# Altium schematic sheet SOM Analog USB.SchDoc: SOM/Analog/USB
size Tabloid; ApprovedBy: NA; CompanyName: Cospan Design LLC; DrawnBy: David McCoy; Engineer: David McCoy; DocumentNumber: 4; Revision: A; SheetNumber: 4; SheetTotal: 18; Client: OSH; Project: Guppy Buddy; ProjectPrettyName: Guppy Buddy
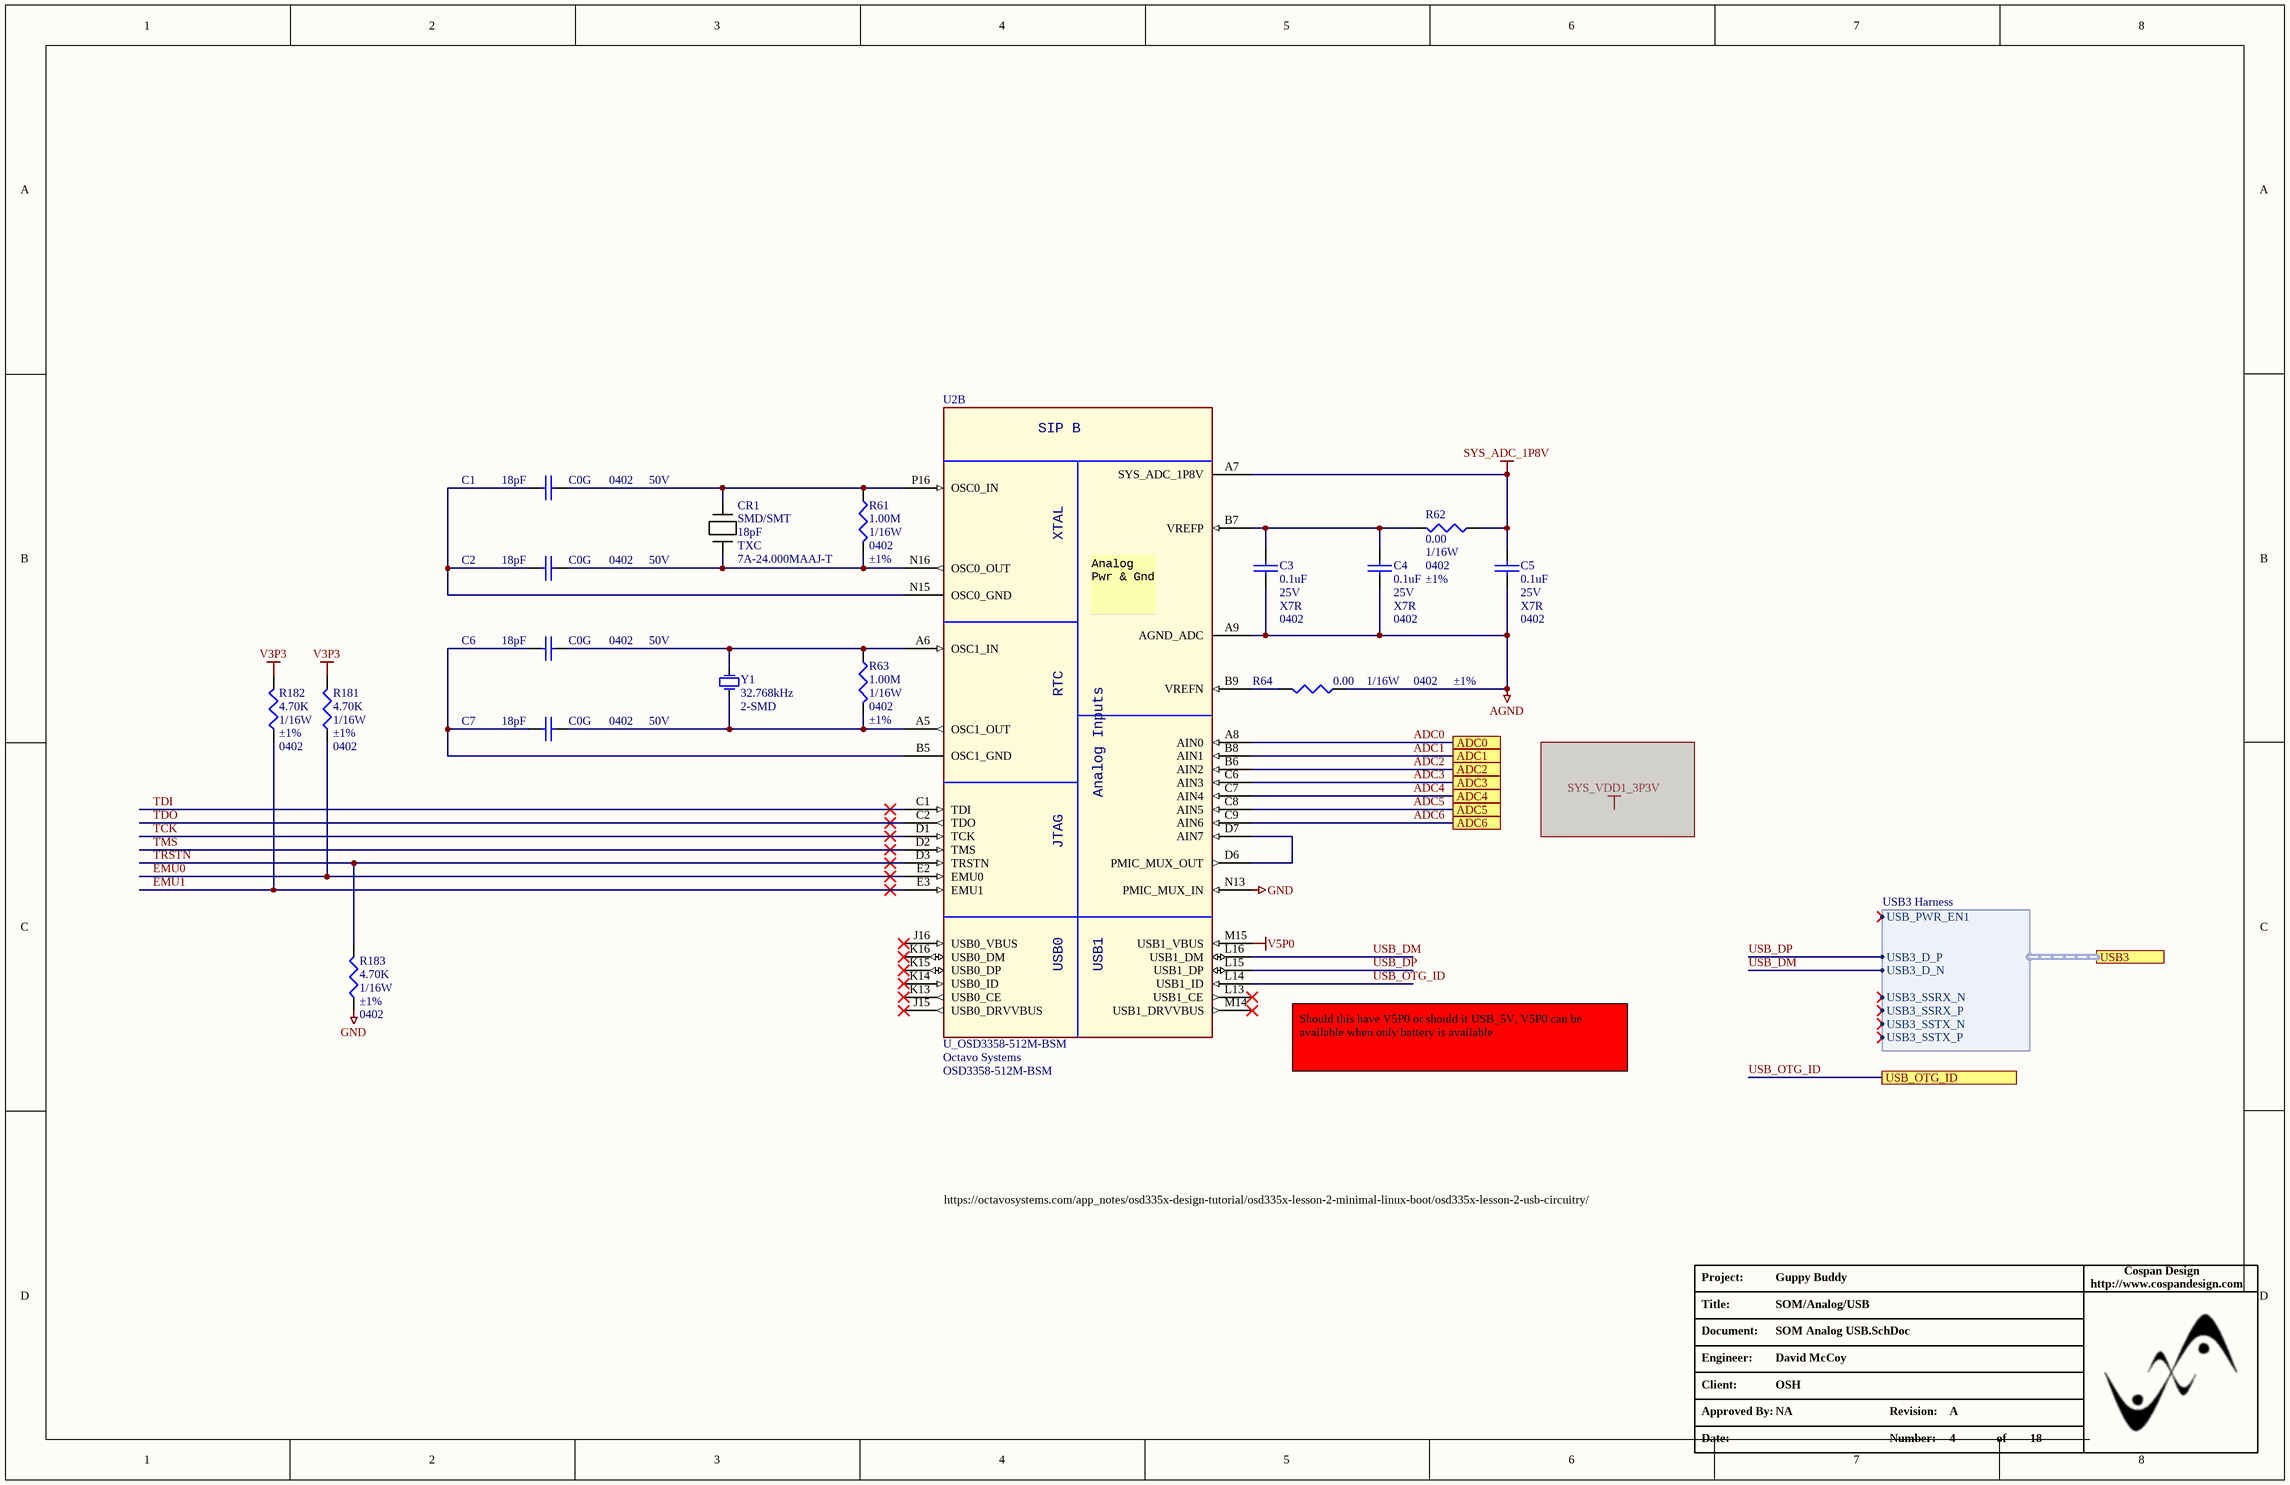
[diagram p0: SOM Analog USB.SchDoc]

## Parts
C1  Capacitance: 18pF  Dielectric: C0G  Case Code (Imperial): 0402  Voltage Rating: 50V  [C_0402]  (hidden comment: C_0402_18PF_50V)
C2  Capacitance: 18pF  Dielectric: C0G  Case Code (Imperial): 0402  Voltage Rating: 50V  [C_0402]  (hidden comment: C_0402_18PF_50V)
C3  Capacitance: 0.1uF  Voltage - Rated: 25V  Temperature Coefficient: X7R  Package / Case: 0402  [C_0402]  (hidden comment: C_0402_0.1UF_25V)
C4  Capacitance: 0.1uF  Voltage - Rated: 25V  Temperature Coefficient: X7R  Package / Case: 0402  [C_0402]  (hidden comment: C_0402_0.1UF_25V)
C5  Capacitance: 0.1uF  Voltage - Rated: 25V  Temperature Coefficient: X7R  Package / Case: 0402  [C_0402]  (hidden comment: C_0402_0.1UF_25V)
C6  Capacitance: 18pF  Dielectric: C0G  Case Code (Imperial): 0402  Voltage Rating: 50V  [C_0402]  (hidden comment: C_0402_18PF_50V)
C7  Capacitance: 18pF  Dielectric: C0G  Case Code (Imperial): 0402  Voltage Rating: 50V  [C_0402]  (hidden comment: C_0402_18PF_50V)
CR1  Case/Package: SMD/SMT  Load Capacitance: 18pF  Manufacturer 1: TXC  Manufacturer Part Number 1: 7A-24.000MAAJ-T  [CRYSTAL_TXC_7A]  (hidden comment: Y_7A-24.000MAAJ-T)
R61  Resistance In Ohms: 1.00M  Power (Watts): 1/16W  Case: 0402  Tolerance: ±1%  [R_0402]  (hidden comment: 1.0M Ohms)
R62  Resistance In Ohms: 0.00  Power (Watts): 1/16W  Case: 0402  Tolerance: ±1%  [R_0402]  (hidden comment: 0.0 Ohms)
R63  Resistance In Ohms: 1.00M  Power (Watts): 1/16W  Case: 0402  Tolerance: ±1%  [R_0402]  (hidden comment: 1.0M Ohms)
R64  Resistance In Ohms: 0.00  Power (Watts): 1/16W  Case: 0402  Tolerance: ±1%  [R_0402]  (hidden comment: 0.0 Ohms)
R181  Resistance In Ohms: 4.70K  Power (Watts): 1/16W  Tolerance: ±1%  Case: 0402  [R_0402]  (hidden comment: 4.7k Ohms)
R182  Resistance In Ohms: 4.70K  Power (Watts): 1/16W  Tolerance: ±1%  Case: 0402  [R_0402]  (hidden comment: 4.7k Ohms)
R183  Resistance In Ohms: 4.70K  Power (Watts): 1/16W  Tolerance: ±1%  Case: 0402  [R_0402]  (hidden comment: 4.7k Ohms)
U2  U_OSD3358-512M-BSM  Manufacturer 1: Octavo Systems  Manufacturer Part Number 1: OSD3358-512M-BSM  [OSD335X-BGA-256]  (part B of 6)
Y1  Frequency: 32.768kHz  Package / Case: 2-SMD  [FC-135_CRYSTAL]  (hidden comment: 32.768kHz (Tuning Fork))

## Ports
ADC0, ADC1, ADC2, ADC3, ADC4, ADC5, ADC6, USB3 (harness USB3 Harness), USB_OTG_ID

## Harnesses
USB3 Harness: USB_PWR_EN1, USB3_D_N, USB3_D_P, USB3_SSRX_N, USB3_SSRX_P, USB3_SSTX_N, USB3_SSTX_P

## Nets
AGND: C3.1 C4.1 C5.1 R64.2 U2.A9(AGND_ADC)
GND: R183.2 U2.N13(PMIC_MUX_IN)
SYS_ADC_1P8V: C5.2 R62.2 U2.A7(SYS_ADC_1P8V)
V3P3: R181.1 R182.1
V5P0: U2.M15(USB1_VBUS)
ADC0: U2.A8(AIN0) ; port ADC0
ADC1: U2.B8(AIN1) ; port ADC1
ADC2: U2.B6(AIN2) ; port ADC2
ADC3: U2.C6(AIN3) ; port ADC3
ADC4: U2.C7(AIN4) ; port ADC4
ADC5: U2.C8(AIN5) ; port ADC5
ADC6: U2.C9(AIN6) ; port ADC6
EMU0: R181.2 U2.E2(EMU0)
EMU1: R182.2 U2.E3(EMU1)
TCK: U2.D1(TCK)
TDI: U2.C1(TDI)
TDO: U2.C2(TDO)
TMS: U2.D2(TMS)
TRSTN: R183.1 U2.D3(TRSTN)
USB_DM: U2.L16(USB1_DM) ; port USB3.USB3_D_N
USB_DP: U2.L15(USB1_DP) ; port USB3.USB3_D_P
USB_OTG_ID: U2.L14(USB1_ID) ; port USB_OTG_ID
NetC1_1: C1.1 C2.1 U2.N15(OSC0_GND)
NetC1_2: C1.2 CR1.2 R61.2 U2.P16(OSC0_IN)
NetC2_2: C2.2 CR1.1 R61.1 U2.N16(OSC0_OUT)
NetC3_2: C3.2 C4.2 R62.1 U2.B7(VREFP)
NetC6_1: C6.1 C7.1 U2.B5(OSC1_GND)
NetC6_2: C6.2 R63.2 U2.A6(OSC1_IN) Y1.1
NetC7_2: C7.2 R63.1 U2.A5(OSC1_OUT) Y1.2
NetR64_1: R64.1 U2.B9(VREFN)
NetU2_D6: U2.D6(PMIC_MUX_OUT) U2.D7(AIN7)

Not connected (* = marked no-connect by the designer): U2 J15(USB0_DRVVBUS)* J16(USB0_VBUS)* K13(USB0_CE)* K14(USB0_ID)* K15(USB0_DP)* K16(USB0_DM)* L13(USB1_CE)* M14(USB1_DRVVBUS)*

## Notes on the sheet
- Should this have V5P0 or should it USB_5V, V5P0 can be available when only battery is available
- https://octavosystems.com/app_notes/osd335x-design-tutorial/osd335x-lesson-2-minimal-linux-boot/osd335x-lesson-2-usb-circuitry/
- Project:
- http://www.cospandesign.com
- Cospan Design
- Document:
- Engineer:
- Title:
- Client:
- Approved By:
- Revision:
- Date:
- Number:
- of
- (in symbol U_OSD3358-512M-BSM, part B) SIP B; XTAL; Analog / Pwr & Gnd; RTC; Analog Inputs; JTAG; USB0; USB1

## Library data of the parts
C1 C2 C6 C7 = C_0402_18PF_50V: Manufacturer Part Number 1: UMK105CG180JV-F; Manufacturer 1: Taiyo Yuden; Tolerance: 5%; Description 1: CAP CER 18PF 50V NP0 0402; Supplier 1: Digi-Key; Supplier Part Number 1: 587-1950-6-ND; Stock 1: 0; Thickness: 0.022inch; Packaging: Tape and Reel; ComponentLink1URL: http://search.murata.co.jp/Ceramy/image/img/A01X/G101/ENG/GRM1555C1H180FA01-01.pdf; ComponentLink1Description: http://search.murata.co.jp/Ceramy/image/img/A01X/G101/ENG/GRM1555C1H180FA01-01.pdf; Pricing 1: 1=0.1, 10=0.032, 100=0.0141, 500=0.01006, 1000=0.00791, 2500=0.00719, 5000=0.00661 (USD); Mount: Surface Mount; Case/Package: 0402; Case Code (Metric): 1005; Min Operating Temperature: -55°C; Max Operating Temperature: 125°C; Package Quantity: 1; Voltage Rating (DC): 50V; Termination: SMD/SMT; Length: 1mm; Height: 0.5mm; Width: 0.02inch; Depth: 0.5mm; Radiation Hardening: No; REACH SVHC: Unknown; Lead Free: Lead Free; Halogen Free: Halogen Free; ComponentLink2URL: https://datasheet.ciiva.com/129/standardmultilayerceramiccaps-129795.pdf; ComponentLink2Description: https://datasheet.ciiva.com/129/standardmultilayerceramiccaps-129795.pdf; ComponentLink3URL: https://datasheet.ciiva.com/129/standardmultilayerceramiccaps-129796.pdf; ComponentLink3Description: https://datasheet.ciiva.com/129/standardmultilayerceramiccaps-129796.pdf; ComponentLink4URL: https://datasheet.ciiva.com/129/standardmultilayerceramiccaps-129797.pdf; ComponentLink4Description: https://datasheet.ciiva.com/129/standardmultilayerceramiccaps-129797.pdf; ComponentLink5URL: https://datasheet.ciiva.com/28645/1481447-28645301.pdf; ComponentLink5Description: https://datasheet.ciiva.com/28645/1481447-28645301.pdf; ComponentLink6URL: https://datasheet.ciiva.com/7975/1500421-7975897.pdf; ComponentLink6Description: https://datasheet.ciiva.com/7975/1500421-7975897.pdf; ComponentLink7URL: https://datasheet.ciiva.com/30064/dumk-e-30064475.pdf; ComponentLink7Description: https://datasheet.ciiva.com/30064/dumk-e-30064475.pdf; ComponentLink8URL: https://datasheet.ciiva.com/5418/mlcc-all-e-541559-5418829.pdf; ComponentLink8Description: https://datasheet.ciiva.com/5418/mlcc-all-e-541559-5418829.pdf
C3-C5 = C_0402_0.1UF_25V: CAP CER 0.1UF 25V X6S 0402; Manufacturer 1: Yageo; Manufacturer Part Number 1: CC0402KRX7R8BB104; Description 1: Cap Ceramic 0.1uF 25V X7R 10% SMD 0402 125C Paper T/R; Tolerance: 10%; Dissipation Factor: 3.5%; ComponentLink1URL: https://product.tdk.com/info/en/catalog/datasheets/mlcc_commercial_general_en.pdf; ComponentLink1Description: https://product.tdk.com/info/en/catalog/datasheets/mlcc_commercial_general_en.pdf; Supplier 1: Digi-Key; Supplier Part Number 1: 311-2077-1-ND; Stock 1: 0; Pricing 1: 1=0.1, 10=0.048, 100=0.0215, 500=0.01534, 1000=0.01205, 2500=0.01095, 5000=0.01007 (USD); Mount: Surface Mount; Case/Package: 0402; Case Code (Imperial): 0402; Case Code (Metric): 1005; Min Operating Temperature: -55°C; Max Operating Temperature: 125°C; Voltage Rating: 25V; Voltage Rating (DC): 25V; Packaging: Tape and Reel; Dielectric: X7R; Termination: SMD/SMT; Composition: Ceramic; Length: 1mm; Height: 0.5mm; Width: 0.02inch; Thickness: 0.022inch; Depth: 0.5mm; Radiation Hardening: No; Lead Free: Lead Free; Halogen Free: Halogen Free; ComponentLink2URL: https://datasheet.ciiva.com/11464/upy-gphc-x7r-6-3v-to-50v-8-11464889.pdf; ComponentLink2Description: https://datasheet.ciiva.com/11464/upy-gphc-x7r-6-3v-to-50v-8-11464889.pdf; ComponentLink3URL: https://datasheet.ciiva.com/13210/upy-gphc-x7r-6-3v-to-50v-8-12304-13210908.pdf; ComponentLink3Description: https://datasheet.ciiva.com/13210/upy-gphc-x7r-6-3v-to-50v-8-12304-13210908.pdf; ComponentLink4URL: https://datasheet.ciiva.com/17437/upy-gphc-x7r-6-3v-to-50v-8-17437357.pdf; ComponentLink4Description: https://datasheet.ciiva.com/17437/upy-gphc-x7r-6-3v-to-50v-8-17437357.pdf
CR1 = Y_7A-24.000MAAJ-T: Imported; Built_By: EMA_UL_Team; Type: DEV; C: Copyright (C) 2015 Accelerated Designs. All rights reserved; Description 1: CRYSTAL 24.000MHZ 18PF SMD; Frequency: 24MHz; Frequency Tolerance: 30ppm; ESR (Equivalent Series Resistance): 50R; Vendor: TXC; Manufacturer_Part_Number: 7A-24.000MAAJ-T; RefDes: RefDes; Value: Value; Supplier 1: Digi-Key; Supplier Part Number 1: 887-1090-1-ND; Stock 1: 70918; Pricing 1: 1=0.72, 10=0.633, 50=0.5912, 100=0.5225, 500=0.495 (USD); Mount: Surface Mount; Number of Pins: 2; Min Operating Temperature: -40°C; Max Operating Temperature: 70°C; Package Quantity: 1000; Tolerance: 30ppm; Packaging: Tape and Reel; Frequency Stability: 30ppm; Termination: SMD/SMT; Length: 5mm; Height: 0.053inch; Width: 3.2mm; Depth: 3.2mm; REACH SVHC: No SVHC; Lead Free: Lead Free; ComponentLink1URL: https://datasheet.ciiva.com/46431/1041607-46431974.pdf; ComponentLink1Description: https://datasheet.ciiva.com/46431/1041607-46431974.pdf; ComponentLink2URL: https://datasheet.ciiva.com/854/7a-854775.pdf; ComponentLink2Description: https://datasheet.ciiva.com/854/7a-854775.pdf; ComponentLink3URL: https://datasheet.ciiva.com/854/7a-854776.pdf; ComponentLink3Description: https://datasheet.ciiva.com/854/7a-854776.pdf; ComponentLink4URL: https://datasheet.ciiva.com/854/7a-854777.pdf; ComponentLink4Description: https://datasheet.ciiva.com/854/7a-854777.pdf; ComponentLink5URL: https://datasheet.ciiva.com/1356/1041607-1356396.pdf; ComponentLink5Description: https://datasheet.ciiva.com/1356/1041607-1356396.pdf
R61 R63 = R_0402_1.0M: RES 1.00M OHM 1/16W 1% 0402 SMD; Manufacturer: Vishay/Dale; Manufacturer Part Number: CRCW04021M00FKED; Temperature Coefficient: ±100ppm/°C; Supplier 1: Digi-Key; RoHS: RoHS Compliant; Category: Resistors; Stock 1: 232720; Pricing: 10=0.083, 50=0.0444, 200=0.0255, 1000=0.0174 (USD); Composition: Thick Film; Features: -; Lead Style: Surface Mount (SMD - SMT); Packaging: Digi-Reel®; ComponentLink1URL: http://www.vishay.com/doc?20035; ComponentLink1Description: http://www.vishay.com/doc?20035; Supplier Part Number 1: 541-1.00MLDKR-ND
R62 R64 = R_0402_0.00: RES 0.00 OHM 1/16W 1% 0402 SMD; Manufacturer: Yageo; Manufacturer Part Number: RC0402JR-070RL; Supplier 1: Digi-Key; RoHS: RoHS Compliant; Category: Resistors; Stock 1: 14041464; Pricing 1: 1=0.1, 10=0.01, 25=0.0068, 50=0.0052, 100=0.0038, 250=0.00288, 500=0.0023, 1000=0.0017, 5000=0.00122 (USD); Packaging: Cut Tape (CT); Part Status: Active; Composition: Thick Film; Features: Moisture Resistant; Temperature Coefficient: -; Operating Temperature: -55°C ~ 155°C; Package / Case: 0402 (1005 Metric); Supplier Device Package: 0402; Size / Dimension: 0.039" L x 0.020" W (1.00mm x 0.50mm); Height - Seated (Max): 0.016" (0.40mm); Failure Rate: -; ComponentLink1URL: http://www.yageo.com/documents/recent/PYu-RC_Group_51_RoHS_L_7.pdf; ComponentLink1Description: http://www.yageo.com/documents/recent/PYu-RC_Group_51_RoHS_L_7.pdf; Supplier Part Number 1: 311-0.0JRCT-ND
R181-R183 = R_0402_4.70K: RES 4.70K OHM 1/16W 1% 0402 SMD; Manufacturer: Yageo; Manufacturer Part Number: RC0402FR-074K7L; Temperature Coefficient: ±100ppm/°C; Supplier 1: Digi-Key; Supplier Part Number 1: 311-4.7KLRCT-ND; RoHS: RoHS Compliant; Category: Resistors; Stock 1: 3610; Pricing: 10=0.014, 100=0.0063, 500=0.00382, 1000=0.0027, 5000=0.00203 (USD); Resistance (Ohms): 4.7K; Composition: Thick Film; Features: -; Package / Case: 0402 (1005 Metric); Size / Dimension: 0.039" L x 0.020" W (1.00mm x 0.50mm); Height: 0.016" (0.40mm); Number of Terminations: 2; Packaging: Cut Tape (CT); ComponentLink1URL: http://www.yageo.com/documents/recent/PYu-RC0402_51_RoHS_L_6.pdf; ComponentLink1Description: http://www.yageo.com/documents/recent/PYu-RC0402_51_RoHS_L_6.pdf
Y1 = Y_SMD_32KHZ: CRYSTAL 32.7680KHZ 12.5PF SMD; Manufacturer: Epson Toyocom Corporation; Manufacturer Part Number: FC-135 32.7680KA-A3; Frequency Tolerance: ±20ppm; Operating Mode: Fundamental; Supplier 1: Digi-Key; Supplier Part Number 1: SE2413CT-ND; RoHS: RoHS Compliant; Category: Crystals and Oscillators; Stock 1: 70403; Pricing: 1=2.98, 10=2.55, 50=2.125, 100=1.9125 (USD); Type: kHz Crystal (Tuning Fork); Frequency Stability: -; Load Capacitance: 12.5pF; Operating Temperature: -40°C ~ 85°C; Mounting Type: Surface Mount; Size / Dimension: 0.126" L x 0.059" W (3.20mm x 1.50mm); Height: 0.035" (0.90mm); Packaging: Cut Tape (CT); ComponentLink1URL: http://www.eea.epson.com/portal/pls/portal/docs/1/1087994.PDF; ComponentLink1Description: http://www.eea.epson.com/portal/pls/portal/docs/1/1087994.PDF
U2 = U_OSD3358-512M-BSM: Supplier 1: Digi-Key; Supplier Part Number 1: 1676-1002-ND; Stock 1: 592; Pricing 1: 1=43.73, 10=41.08, 100=36.84 (USD)